# EAGLE design ATtiny_4585_dev_board_with_power (EAGLE 6.1)
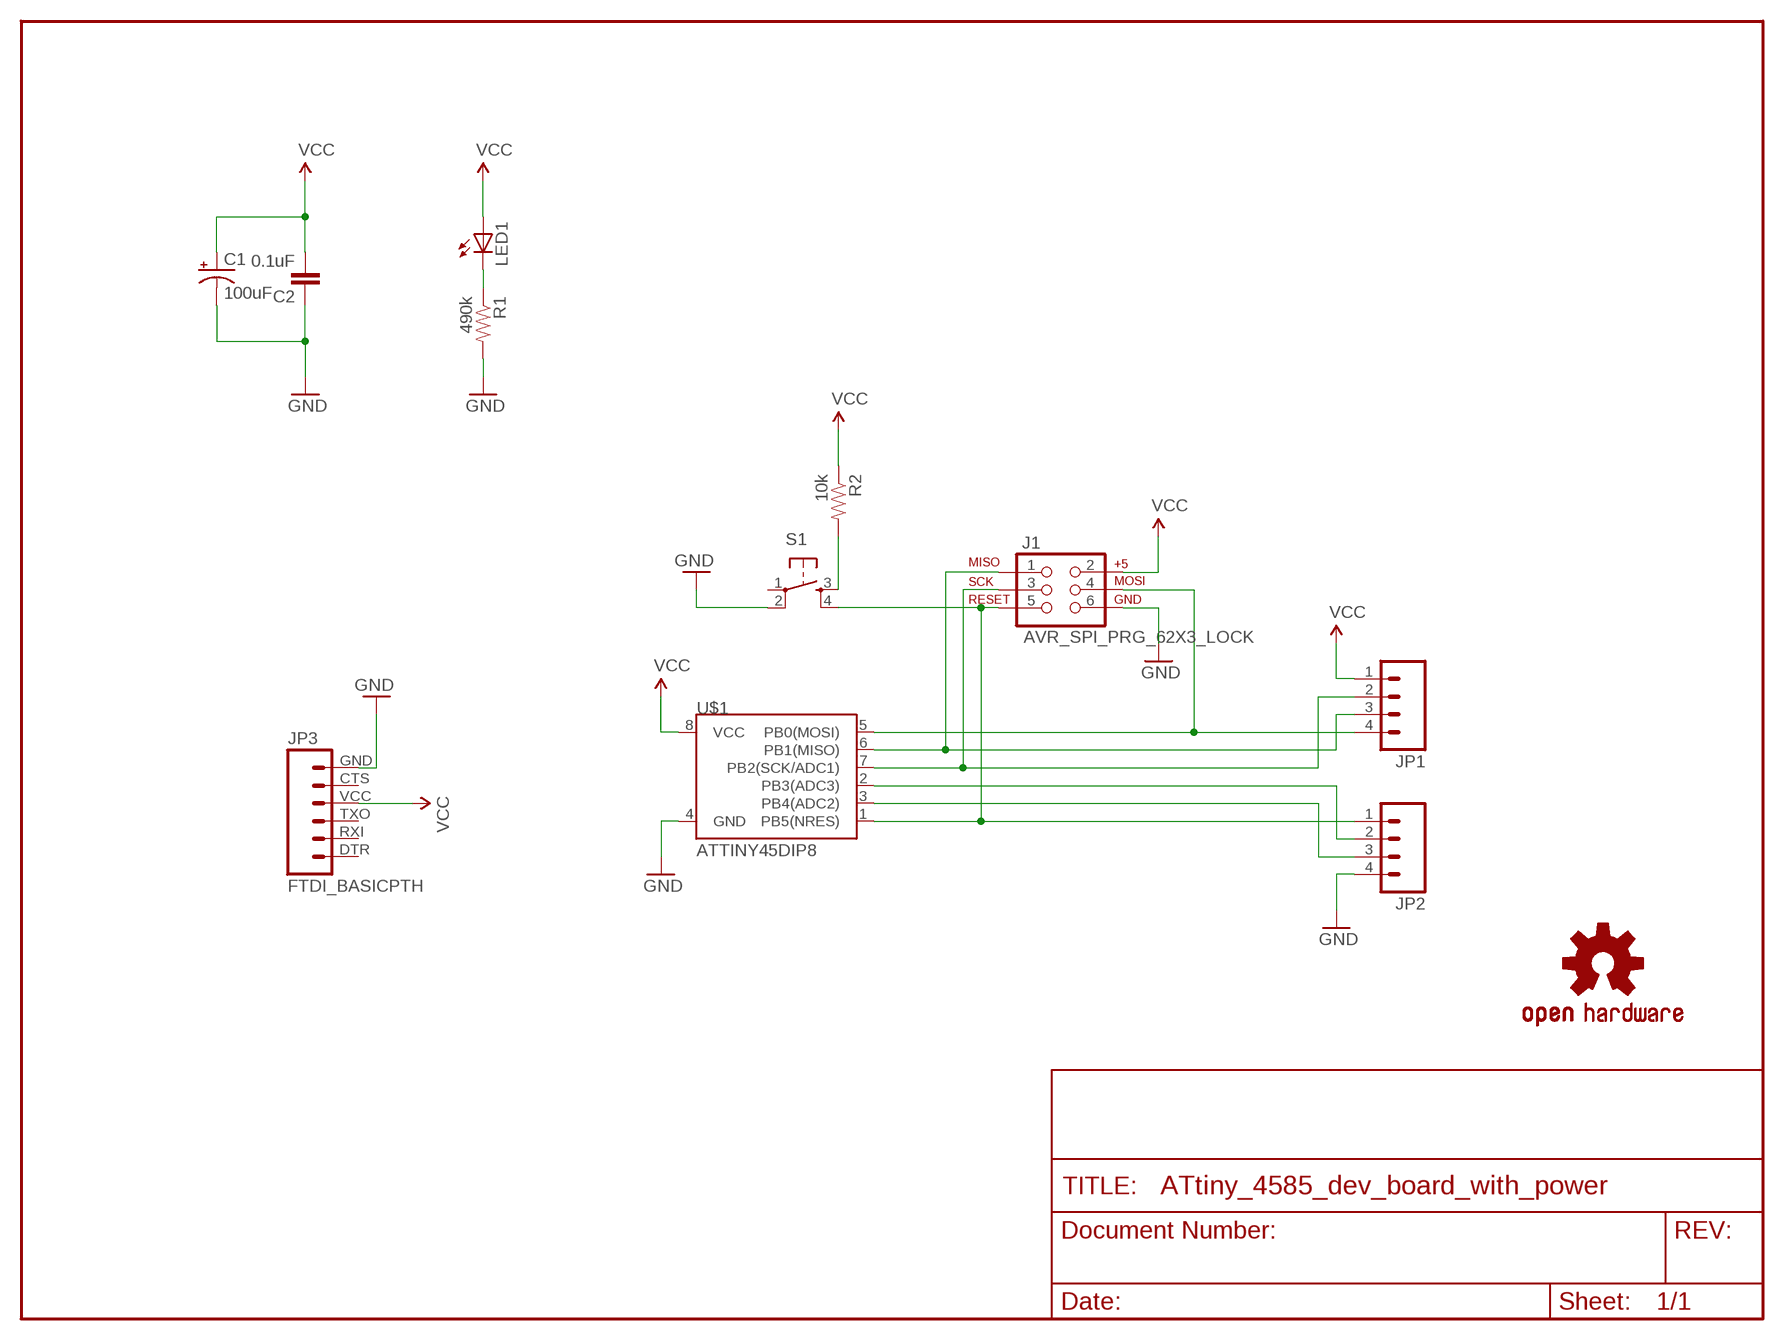
[diagram p0: schematic, sheet 1]

## Parts
C1  100uF  CAP_POLPTH1  [CPOL-RADIAL-100UF-25V]
C2  0.1uF  CAPPTH1  [CAP-PTH-5MM]
J1  AVR_SPI_PRG_62X3_LOCK  [2X3_LOCK]
JP1  M04LOCK  [1X04_LOCK]
JP2  M04LOCK  [1X04_LOCK]
JP3  FTDI_BASICPTH  [FTDI_BASIC]
LED1  LED5MM  [LED5MM]
R1  490k  RESISTORPTH-1/4W  [AXIAL-0.4]
R2  10k  RESISTORPTH-1/4W  [AXIAL-0.4]
S1  TAC_SWITCHPTH  [TACTILE-PTH]
U$1  ATTINY45DIP8  [DIP08]
U$2  OSHW-LOGOS  [OSHW-LOGO-S]

## Nets
GND: C1.2(-) C2.1 J1.6 JP2.4 JP3.GND R1.P$2 S1.2 U$1.4(GND)
N$1: LED1.K(C) R1.P$1
N$2: J1.4 JP1.4 U$1.5(PB0(MOSI))
N$3: J1.5 JP2.1 S1.4 U$1.1(PB5(NRES))
N$6: J1.1 JP1.3 U$1.6(PB1(MISO))
N$7: J1.3 JP1.2 U$1.7(PB2(SCK/ADC1))
N$8: R2.P$2 S1.3
N$9: JP2.2 U$1.2(PB3(ADC3))
N$10: JP2.3 U$1.3(PB4(ADC2))
VCC: C1.1(+) C2.2 J1.2 JP1.1 JP3.VCC LED1.A R2.P$1 U$1.8(VCC)
Unconnected: JP3.CTS JP3.DTR JP3.RXI JP3.TXO S1.1

## Library data of the parts
C1 = SparkFun:CAP_POL: Capacitor Polarized These are standard SMD and PTH capacitors. Normally 10uF, 47uF, and 100uF in electrolytic and tantalum varieties. Always verify the external diameter of the through hole cap, it varies with capacity, voltage, and manufacturer. The EIA devices should be standard.
C2 = SparkFun:CAP: Capacitor Standard 0603 ceramic capacitor, and 0.1" leaded capacitor.
J1 = SparkFun:AVR_SPI_PRG_6: AVR ISP 6 Pin This is the reduced ISP connector for AVR programming. Common on Arduino. This footprint will take up less PCB space and can be used with a 10-pin to 6-pin adapter such as SKU: BOB-08508
JP1 JP2 = SparkFun:M04: Header 4 Standard 4-pin 0.1" header. Use with straight break away headers (SKU : PRT-00116), right angle break away headers (PRT-00553), swiss pins (PRT-00743), machine pins (PRT-00117), and female headers (PRT-00115). Molex polarized connector foot print use with SKU : PRT-08231 with associated crimp pins and housings. 1MM SMD Version SKU: PRT-10208
JP3 = SparkFun:FTDI_BASIC: FTDI Basic: 3.3V and 5V
LED1 = SparkFun:LED: LEDs Standard schematic elements and footprints for 5mm, 3mm, 1206, and 0603 sized LEDs. 5mm - Spark Fun Electronics SKU : COM-00529 (and others)
R1 R2 = SparkFun:RESISTOR: Resistor Basic schematic elements and footprints for 0603, 1206, and PTH resistors.
S1 = SparkFun:TAC_SWITCH: Momentary Switch Button commonly used for reset or general input. Spark Fun Electronics SKU : COM-00097
U$1 = SparkFun:ATTINY45: Atmel ATTiny45
U$2 = SparkFun:OSHW-LOGO: Open Source Hardware Logo This logo indicates the piece of hardware it is found on incorporates a OSHW license and/or adheres to the definition of open source hardware found here: http://freedomdefined.org/OSHW

## Board
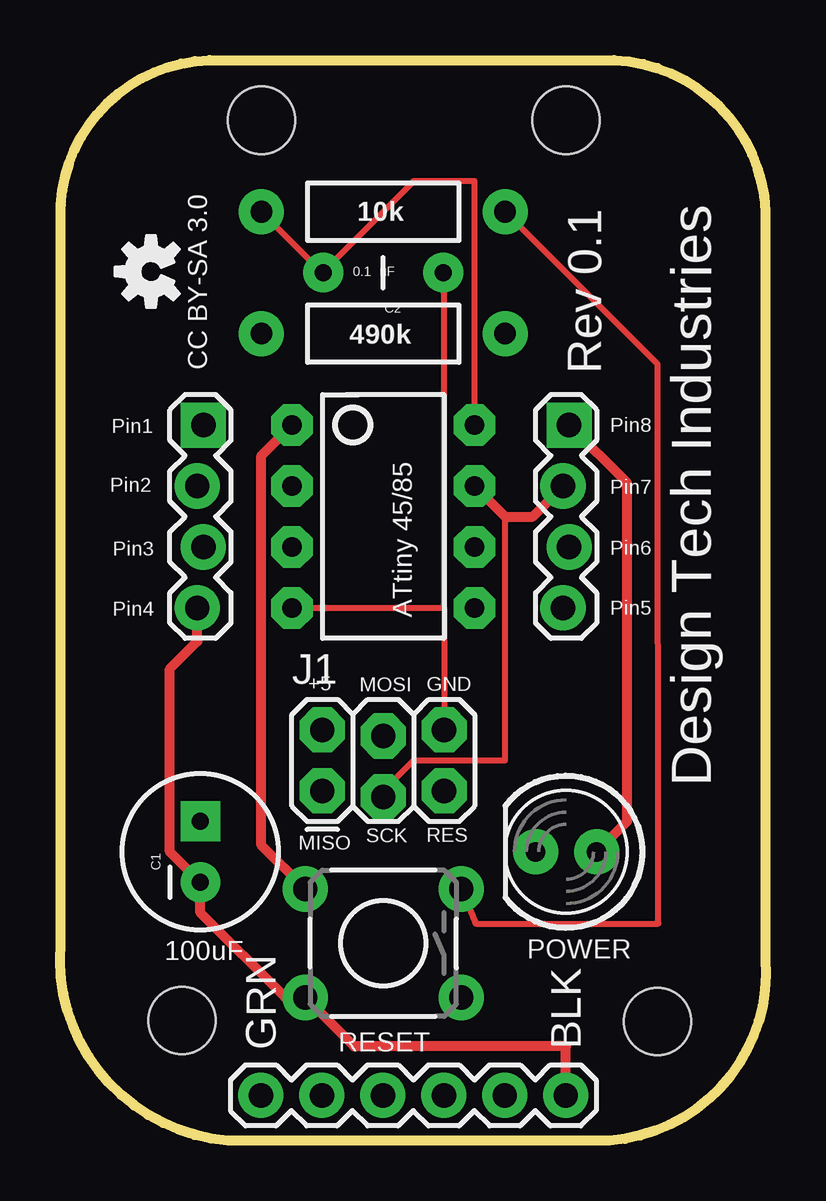
[diagram p1: board, top side]
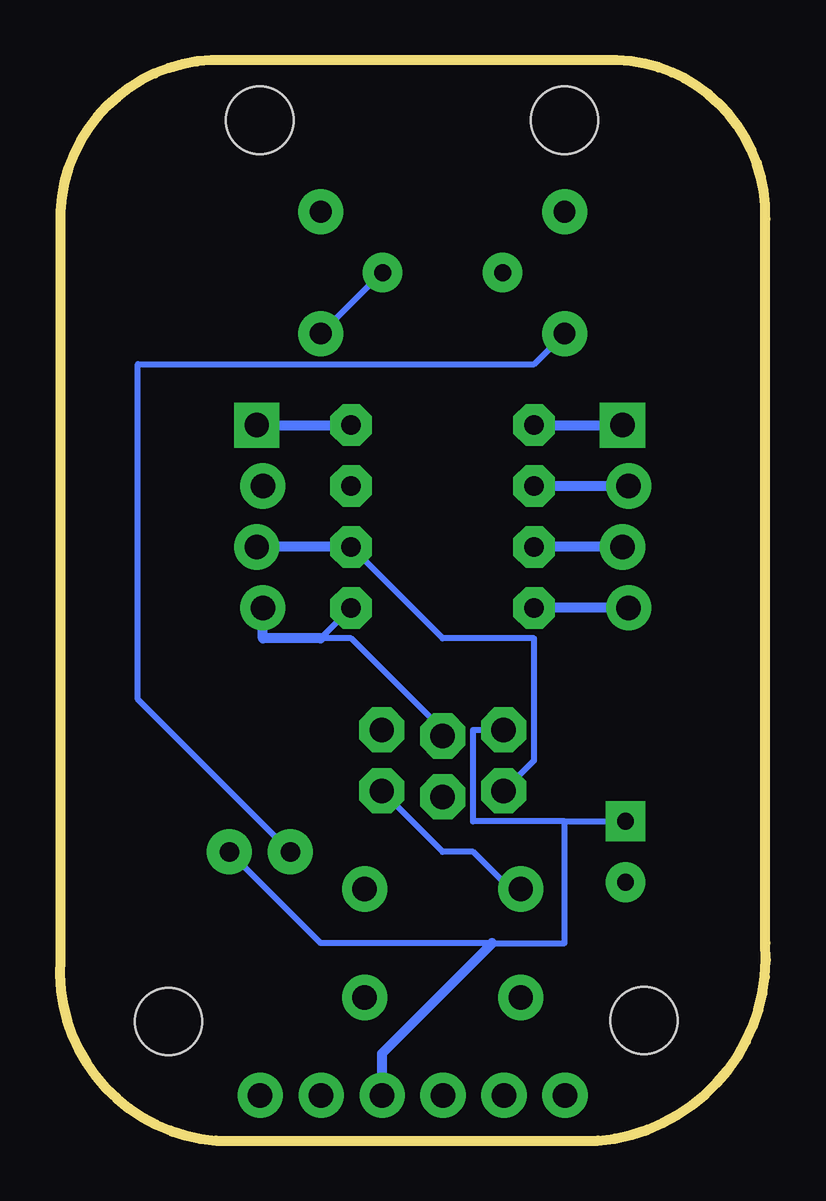
[diagram p2: board, bottom side, seen from below]

Size 29.41 x 45.03 mm. Coordinates in mm from the lower left corner, seen from the top.
Outline: 0.03,38.4 arc-90 6.22,45.03 23.09,45.03 arc-90 29.39,38.11 29.39,7.56 arc-90 22.91,0 7,0 arc-90 0.03,8.23 0.03,38.4
Copper layers (1*16): Top 0.035mm / dielectric 1.5mm / Bottom 0.035mm
Design rules: minimum track width 8mil, minimum drill 20mil, track to track 8mil, track to pad 8mil, pad to pad 8mil, via to via 8mil, smd to smd 8mil, copper to edge 10mil, drill to drill 8mil, minimum pad ring 12mil, minimum via ring 10mil, stop-mask expansion 4mil, vias tented up to drill 25mil, thermal gap 10mil
Holes 2.8 mm at 5.09,5.01 24.9,4.97 8.39,42.52 21.09,42.52

### Footprints (pad centres in the part's own frame; a part is rotated, then mirrored left to right if it is on the bottom)
CPOL-RADIAL-100UF-25V = drill 0.7 pad 1.651 square: 1 1.27,0 | drill 0.7 pad 1.651: 2 -1.27,0
CAP-PTH-5MM = drill 0.7 pad 1.651: 1 -2.5,0; 2 2.5,0
2X3_LOCK = drill 1.016 pad 1.88 octagon: 1 0,0; 2 0,2.54; 3 2.54,-0.254; 4 2.54,2.286; 5 5.08,0; 6 5.08,2.54
1X04_LOCK = drill 1.016 pad 1.88 square: 1 0,0.127 | drill 1.016 pad 1.88: 2 2.54,-0.127; 3 5.08,0.127; 4 7.62,-0.127
FTDI_BASIC = drill 1.016 pad 1.88: CTS 10.16,0; DTR 0,0; GND 12.7,0; RXI 2.54,0; TXO 5.08,0; VCC 7.62,0
LED5MM = drill 0.813 pad 1.88: A -1.27,0; K 1.27,0
AXIAL-0.4 = drill 0.9 pad 1.88: P$1 -5.08,0; P$2 5.08,0
TACTILE-PTH = drill 1.016 pad 1.88: 1 -3.251,2.261; 2 3.251,2.261; 3 -3.251,-2.261; 4 3.251,-2.261
DIP08 = drill 0.813 pad 1.727 octagon: 1 -3.81,-3.81; 2 -1.27,-3.81; 3 1.27,-3.81; 4 3.81,-3.81; 5 3.81,3.81; 6 1.27,3.81; 7 -1.27,3.81; 8 -3.81,3.81

### Placement (x,y rotation side)
C1  5.85,12.04 90 top
C2  13.47,36.17 180 top
J1  10.93,14.58 0 top
JP1  21.09,29.82 270 top
JP2  5.85,29.82 270 top
JP3  8.37,1.89 0 top
LED1  21.09,12.04 180 top
R1  13.47,33.63 0 top
R2  13.47,38.71 0 top
S1  13.47,8.23 180 top
U$1  13.47,26.01 270 top
U$2  3.79,36.21 90 top

### Tracks (layer width: path | path; a pad name or v marks a point on that pad's centre or on a via)
GND
  Top 0.254: 16.01,22.2 16.01,36.17 C2.1 | 16.01,22.2 J1.6 | U$1.4 16.01,22.2
  Top 0.406: JP2.4 5.72,20.8 4.58,19.66 4.58,12.04 C1.2 5.85,9.5 9.38,5.97 S1.2 12.25,3.93 21.08,3.93 21.07,3.92 JP3.GND
  Bottom 0.254: R1.P$2 16.01,36.17 C2.1
  Bottom 0.406: JP2.4 U$1.4
N$1
  Bottom 0.254: LED1.K 26.17,18.39 26.17,32.36 9.66,32.36 R1.P$1
N$2
  Bottom 0.254: U$1.5 18.55,20.93 17.28,20.93 13.47,17.12 J1.4
  Bottom 0.406: 18.55,20.93 20.96,20.93 JP1.4
N$3
  Top 0.406: U$1.1 8.39,28.55 8.39,12.32 S1.4
  Bottom 0.254: J1.5 13.47,12.04 12.2,12.04 10.93,10.77 S1.4
  Bottom 0.406: U$1.1 JP2.1
N$6
  Bottom 0.254: J1.1 9.66,15.85 9.66,20.93 13.47,20.93 U$1.6
  Bottom 0.406: U$1.6 JP1.3
N$7
  Top 0.254: 18.55,26.01 18.55,15.85 14.74,15.85 13.47,14.58 J1.3
  Top 0.406: JP1.2 19.69,26.01 18.55,26.01 U$1.7
N$8
  Top 0.254: R2.P$2 24.9,32.36 24.94,9.04 17.32,9.04 S1.3
N$9
  Bottom 0.406: JP2.2 U$1.2
N$10
  Bottom 0.406: JP2.3 U$1.3
VCC
  Top 0.254: 10.93,36.17 R2.P$1 | 10.93,36.17 14.74,39.98 17.28,39.98 U$1.8 | 10.93,36.17 C2.2
  Top 0.406: JP1.1 23.63,27.4 23.63,13.31 LED1.A
  Bottom 0.254: 8.39,13.31 12.2,13.31 12.2,17.12 J1.2 | 8.39,13.31 C1.1 | 8.39,13.31 8.39,8.23 11.4,8.23 18.55,8.23 LED1.A
  Bottom 0.406: JP1.1 U$1.8 | JP3.VCC 15.99,3.64 11.4,8.23

### Text on the board
tPlace: Design Tech Industries | 0.1 uF | CC BY-SA 3.0 | Rev 0.1 | Pin1 | Pin8 | Pin2 | Pin7 | Pin3 | Pin6 | Pin4 | Pin5 | ATtiny 45/85 | +5 | MOSI | GND | MISO | SCK | RES | 100uF | POWER | RESET | GRN | BLK